# Altium schematic sheet MCU.SchDoc
size A4
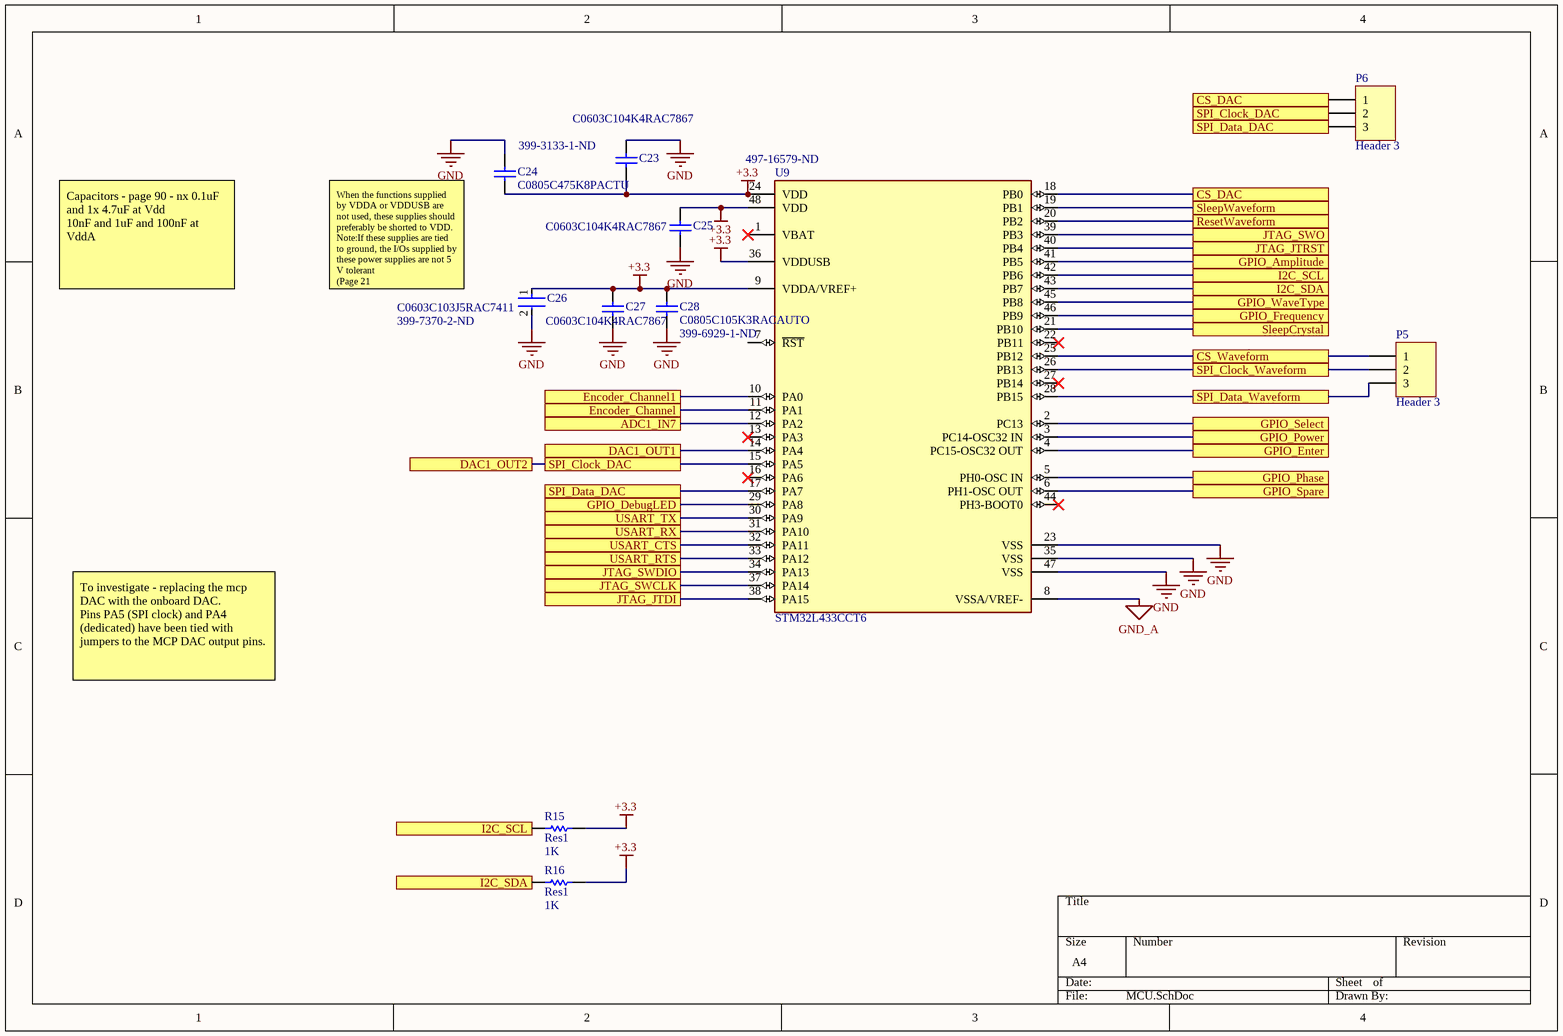
[diagram p0: MCU.SchDoc]

## Parts
C23  C0603C104K4RAC7867  [CAPC1608X87X35NL15T15]
C24  C0805C475K8PACTU  Supplier Part Number 1: 399-3133-1-ND  [CAPC2013X145X50ML20T25]
C25  C0603C104K4RAC7867  [CAPC1608X87X35NL15T15]
C26  C0603C103J5RAC7411  Supplier Part Number 1: 399-7370-2-ND  [FP-C0603C-CF-MFG]
C27  C0603C104K4RAC7867  [CAPC1608X87X35NL15T15]
C28  C0805C105K3RACAUTO  Supplier Part Number 1: 399-6929-1-ND  [CAPC2013X140X50ML20T25]
P5  Header 3  [HDR1X3]
P6  Header 3  [HDR1X3]
R15  Res1  value 1K  [AXIAL-0.3]
R16  Res1  value 1K  [AXIAL-0.3]
U9  STM32L433CCT6  Supplier Part Number 1: 497-16579-ND  [FP-LQFP48-5B-MFG]

## Ports
ADC1_IN7, CS_DAC, CS_Waveform, DAC1_OUT1, DAC1_OUT2, Encoder_Channel, Encoder_Channel1, GPIO_Amplitude, GPIO_DebugLED, GPIO_Enter, GPIO_Frequency, GPIO_Phase, GPIO_Power, GPIO_Select, GPIO_Spare, GPIO_WaveType, I2C_SCL, I2C_SDA, JTAG_JTDI, JTAG_JTRST, JTAG_SWCLK, JTAG_SWDIO, JTAG_SWO, ResetWaveform, SleepCrystal, SleepWaveform, SPI_Clock_DAC, SPI_Clock_Waveform, SPI_Data_DAC, SPI_Data_Waveform, USART_CTS, USART_RTS, USART_RX, USART_TX

## Nets
+3.3: C23.1 C24.1 C25.2 C26.1 C27.2 C28.2 R15.2 R16.2 U9.9(VDDA/VREF+) U9.24(VDD) U9.36(VDDUSB) U9.48(VDD)
GND: C23.2 C24.2 C25.1 C26.2 C27.1 C28.1 U9.23(VSS) U9.35(VSS) U9.47(VSS)
GND_A: U9.8(VSSA/VREF-)
ADC1_IN7: U9.12(PA2) ; port ADC1_IN7
CS_DAC: P6.1 U9.18(PB0) ; port CS_DAC
CS_Waveform: P5.1 U9.25(PB12) ; port CS_Waveform
DAC1_OUT1: U9.14(PA4) ; port DAC1_OUT1
DAC1_OUT2: P6.2 U9.15(PA5) ; port DAC1_OUT2, port SPI_Clock_DAC
Encoder_Channel: U9.11(PA1) ; port Encoder_Channel
Encoder_Channel1: U9.10(PA0) ; port Encoder_Channel1
GPIO_Amplitude: U9.41(PB5) ; port GPIO_Amplitude
GPIO_DebugLED: U9.29(PA8) ; port GPIO_DebugLED
GPIO_Enter: U9.4(PC15-OSC32_OUT) ; port GPIO_Enter
GPIO_Frequency: U9.46(PB9) ; port GPIO_Frequency
GPIO_Phase: U9.5(PH0-OSC_IN) ; port GPIO_Phase
GPIO_Power: U9.3(PC14-OSC32_IN) ; port GPIO_Power
GPIO_Select: U9.2(PC13) ; port GPIO_Select
GPIO_Spare: U9.6(PH1-OSC_OUT) ; port GPIO_Spare
GPIO_WaveType: U9.45(PB8) ; port GPIO_WaveType
I2C_SCL: R15.1 U9.42(PB6) ; port I2C_SCL
I2C_SDA: R16.1 U9.43(PB7) ; port I2C_SDA
JTAG_JTDI: U9.38(PA15) ; port JTAG_JTDI
JTAG_JTRST: U9.40(PB4) ; port JTAG_JTRST
JTAG_SWCLK: U9.37(PA14) ; port JTAG_SWCLK
JTAG_SWDIO: U9.34(PA13) ; port JTAG_SWDIO
JTAG_SWO: U9.39(PB3) ; port JTAG_SWO
ResetWaveform: U9.20(PB2) ; port ResetWaveform
SleepCrystal: U9.21(PB10) ; port SleepCrystal
SleepWaveform: U9.19(PB1) ; port SleepWaveform
SPI_Clock_Waveform: P5.2 U9.26(PB13) ; port SPI_Clock_Waveform
SPI_Data_DAC: P6.3 U9.17(PA7) ; port SPI_Data_DAC
SPI_Data_Waveform: P5.3 U9.28(PB15) ; port SPI_Data_Waveform
USART_CTS: U9.32(PA11) ; port USART_CTS
USART_RTS: U9.33(PA12) ; port USART_RTS
USART_RX: U9.31(PA10) ; port USART_RX
USART_TX: U9.30(PA9) ; port USART_TX

Not connected (* = marked no-connect by the designer): U9 1(VBAT)* 7(~{RST}) 13(PA3)* 16(PA6)* 22(PB11)* 27(PB14)* 44(PH3-BOOT0)*

## Notes on the sheet
- Capacitors - page 90 - nx 0.1uF and 1x 4.7uF at Vdd
  10nF and 1uF and 100nF at VddA
- (near C24) When the functions supplied by VDDA or VDDUSB are not used, these supplies should preferably be shorted to VDD.
  Note:If these supplies are tied to ground, the I/Os supplied by these power supplies are not 5 V tolerant
  (Page 21
- To investigate - replacing the mcp DAC with the onboard DAC.
  Pins PA5 (SPI clock) and PA4 (dedicated) have been tied with jumpers to the MCP DAC output pins.

## Library data of the parts
C23 C25 C27 = CMP-2006-03811-1: 0.1uF Ceramic; Manufacturer: Kemet; Capacitance: 100nF; Voltage Rating: 16V; Tolerance: 10%; Dielectric: X7R; Dissipation Factor: 3.5%; Part Number: C0603C104K4RAC7867; RoHS: Yes; Category: Ceramic Capacitors; Stock 1: 2000839; Pricing 1: 1=0.12000, 10=0.08700, 50=0.04720, 100=0.03850, 500=0.02752, 1000=0.02163 (USD); Mount: Surface Mount,PCB; Case/Package: 0603; Number of Pins: 2; Case Code (Metric): 1608; Case Code (Imperial): 0603; Dielectric Material: Ceramic; Contact Plating: Tin,Matte; Min Operating Temperature: -55°C; Max Operating Temperature: 125°C; Package Quantity: 4000; Packaging: Tape and Reel; Voltage Rating (DC): 16V; Termination: SMD/SMT; Voltage: 16V; Length: 1.6mm; Height: 0.8mm; Width: 0.8mm; Thickness: 0.034inch; Depth: 0.8mm; Lead Pitch: 0.7mm; Radiation Hardening: No; REACH SVHC: No SVHC; ComponentLink1URL: https://datasheet.ciiva.com/14589/70095383-14589014.pdf?src-supplier=Allied+Electronics; ComponentLink1Description: https://datasheet.ciiva.com/14589/70095383-14589014.pdf?src-supplier=Allied+Electronics; ComponentLink2URL: https://datasheet.ciiva.com/18192/getdatasheetpartid-330584-18192695.pdf?src-supplier=Verical; ComponentLink2Description: https://datasheet.ciiva.com/18192/getdatasheetpartid-330584-18192695.pdf?src-supplier=Verical; ComponentLink3URL: https://datasheet.ciiva.com/22749/kem-c1002-x7r-smd-22749657.pdf?src-supplier=Element14; ComponentLink3Description: https://datasheet.ciiva.com/22749/kem-c1002-x7r-smd-22749657.pdf?src-supplier=Element14; ComponentLink4URL: https://datasheet.ciiva.com/5413/kem-c1002-x7r-smd-5413791.pdf?src-supplier=Mouser; ComponentLink4Description: https://datasheet.ciiva.com/5413/kem-c1002-x7r-smd-5413791.pdf?src-supplier=Mouser
C24 = CMP-2007-01007-1: Manufacturer: Kemet; Dielectric Material: Ceramic; Tolerance: 10%; Capacitance: 4.7uF; Voltage Rating (DC): 10V; Dielectric: X5R; Dissipation Factor: 5%; Part Number: C0805C475K8PACTU; Supplier 1: Digi-Key; Manufacturer Part Number: C0805C475K8PACTU; RoHS: Yes; Category: Ceramic Capacitors; Stock 1: 286427; Pricing 1: 1=0.25000, 10=0.17100, 50=0.10240, 100=0.08640, 500=0.05914, 1000=0.05232 (USD); Mount: Surface Mount; Case/Package: 0805; Number of Pins: 2; Case Code (Imperial): 0805; Case Code (Metric): 2012; Min Operating Temperature: -55°C; Max Operating Temperature: 85°C; Packaging: Tape and Reel; Termination: SMD/SMT; Package Quantity: 1; Voltage Rating: 10V; Voltage: 10V; Length: 2mm; Height: 1.25mm; Width: 1.2mm; Thickness: 0.055inch; Depth: 1.25mm; Lead Pitch: 0.75mm; Radiation Hardening: No; Lead Free: Lead Free; REACH SVHC: No SVHC; ComponentLink1URL: https://datasheet.ciiva.com/18193/getdatasheetpartid-179373-18193909.pdf?src-supplier=Verical; ComponentLink1Description: https://datasheet.ciiva.com/18193/getdatasheetpartid-179373-18193909.pdf?src-supplier=Verical; ComponentLink2URL: https://datasheet.ciiva.com/7842/40889-7842616.pdf?src-supplier=Element14; ComponentLink2Description: https://datasheet.ciiva.com/7842/40889-7842616.pdf?src-supplier=Element14; ComponentLink3URL: https://datasheet.ciiva.com/6126/40889-6126699.pdf?src-supplier=Farnell; ComponentLink3Description: https://datasheet.ciiva.com/6126/40889-6126699.pdf?src-supplier=Farnell; ComponentLink4URL: https://datasheet.ciiva.com/28614/1918694-28614763.pdf?src-supplier=Element14; ComponentLink4Description: https://datasheet.ciiva.com/28614/1918694-28614763.pdf?src-supplier=Element14; ComponentLink5URL: https://datasheet.ciiva.com/46385/1791935-46385676.pdf?src-supplier=Element14; ComponentLink5Description: https://datasheet.ciiva.com/46385/1791935-46385676.pdf?src-supplier=Element14
C26 = CMP-03020-011072-1: CAP CER 10000PF 50V X7R 0603; Manufacturer: KEMET; Value: 10,000 pF; Tolerance: 0.05; Automotive Grade: Grade 1; Material: Ceramic; Temperature Coefficient: 30ppm/°C; Dissipation Factor: 2.5%; Lead Free: Yes; Voltage Rating: 50 V; Temperature: -55°C to +125°C; Digikey Description: CAP CER 10000PF 50V X7R 0603; Device Class L2: Capacitors; Package: C0603C-CF; Device Class L3: Ceramic Capacitors; Height: 0.87mm; ComponentLink2Description: Datasheet; Temperature Range High: +125°C; Capacitance: 10,000 pF; Octopart: https://octopart.com/c0603c103j5rac7411-kemet-3901156; ComponentLink2URL: https://api.kemet.com/component-edge/download/datasheet/C0603C100J5GACAUTO.pdf; Category: Cap; Automotive: Yes; Temperature Range Low: -55°C; Mouser Description: Cap Ceramic 0.01uF 50V X7R 5% SMD 0603 125°C Punched Paper T/R; Temperature Characteristic: X7R; RoHS: TRUE; Manufacturer Part Number: C0603C103J5RAC7411; Device Class L1: Passive Components; Supplier 1: Digi-Key; Stock 1: 15000; Pricing 1: 15000=0.00836, 30000=0.00794, 75000=0.00711 (USD); Mount: Surface Mount; Case/Package: 0603; Case Code (Metric): 1608; Case Code (Imperial): 0603; Dielectric Material: Ceramic; Min Operating Temperature: -55°C; Max Operating Temperature: 125°C; Packaging: Tape and Reel; Voltage Rating (DC): 50V; Dielectric: X7R; Package Quantity: 15000; Termination: SMD/SMT; Length: 1.6mm; Width: 0.031inch; Depth: 0.8mm; Thickness: 0.035inch; Lead Pitch: 0.7mm; ComponentLink1URL: https://datasheet.ciiva.com/5411/kem-c1002-x7r-smd-357932-5411286.pdf?src-supplier=Mouser; ComponentLink1Description: https://datasheet.ciiva.com/5411/kem-c1002-x7r-smd-357932-5411286.pdf?src-supplier=Mouser
C28 = CMP-2007-03233-1: Manufacturer: Kemet; Dielectric Material: Ceramic; Capacitance: 1uF; Tolerance: 10%; Dielectric: X7R; Voltage Rating (DC): 25V; Part Number: C0805C105K3RACAUTO; Supplier 1: Digi-Key; Manufacturer Part Number: C0805C105K3RACAUTO; RoHS: Yes; Category: Ceramic Capacitors; Stock 1: 71727; Pricing 1: 1=0.18000, 10=0.12100, 50=0.07280, 100=0.06140, 500=0.04204, 1000=0.03719 (USD); Mount: Surface Mount; Case/Package: 0805; Case Code (Metric): 2012; Case Code (Imperial): 0805; Min Operating Temperature: -55°C; Max Operating Temperature: 125°C; Packaging: Cut Tape; Voltage Rating: 25V; Package Quantity: 1; Length: 2mm; Height: 1.25mm; Width: 0.049inch; Thickness: 0.055inch; Depth: 1.25mm; Ratings: AEC-Q200; Radiation Hardening: No; REACH SVHC: No SVHC; ComponentLink1URL: https://datasheet.ciiva.com/6074/1732735-6074357.pdf?src-supplier=Farnell; ComponentLink1Description: https://datasheet.ciiva.com/6074/1732735-6074357.pdf?src-supplier=Farnell; ComponentLink2URL: https://datasheet.ciiva.com/7842/1732735-7842186.pdf?src-supplier=Element14; ComponentLink2Description: https://datasheet.ciiva.com/7842/1732735-7842186.pdf?src-supplier=Element14
P5 P6 = Header 3: Header, 3-Pin; LatestRevisionDate: 17-Jul-2002; LatestRevisionNote: Re-released for DXP Platform.; Publisher: Altium Limited
R15 R16 = Res1: Resistor; Published: 8-Jun-2000; LatestRevisionDate: 17-Jul-2002; LatestRevisionNote: Re-released for DXP Platform.; PackageReference: AXIAL-0.3; Publisher: Altium Limited; PackageDescription: Axial Device, Thru-Hole; 2 Leads; 0.3 in Pin Spacing
U9 = CMP-12105-000047-1: IC MCU 32BIT 256KB FLASH 48LQFP; Manufacturer: STMicroelectronics; Max Junction Temp: +105°C; Min Supply Voltage: 1.55V; Number Of Uart Channels: 4; Number Of I2C Channels: 3; Max Supply Voltage: 3.6V; Number Of I/Os: 38; Number Of Usb Channels: 1; Memory Size: 256KBytes; Interface: I2C,SPI,UART,USART,CAN,USB,LIN,IrDA,SMBus,Other; Ram Size: 64KBytes; Standoff Height: 0.05mm; Number Of Pwm Channels: 14; Number Of Timers/Counters: 9; Frequency: 80MHz; Data Bus Width: 32bits; Number Of Adc Channels: 10; Core Architecture: Arm Cortex-M4; Peripherals: Brown-out Detect/Reset,PWM,WDT,DMA,LCD; Oscillator Type: Internal; Digikey Description: IC MCU 32BIT 256KB FLASH 48LQFP; Category: IC; Ambient Temperature Range High: +85°C; Number Of Spi Channels: 3; Temperature Range High: +85°C; ComponentLink2Description: Datasheet; Device Class L3: Microcontrollers; Device Class L2: Embedded Processors and Controllers; Temperature Range Low: -40°C; Ambient Temperature Range Low: -40°C; Manufacturer Part Number: STM32L433CCT6; Automotive: No; Package: LQFP48-5B; Ipc Land Pattern Name: QFP50P900X900X160-48; RoHS: TRUE; Octopart: https://octopart.com/stm32l433cct6-stmicroelectronics-71093511; Number Of A/D Converters: 1; Memory Type: FLASH; Lead Free: Yes; ComponentLink2URL: https://www.st.com/resource/en/datasheet/stm32l433cc.pdf; Device Class L1: Integrated Circuits (ICs); Temperature: -40°C to +85°C; Number Of Cores: 1; Height: 1.6mm; Supplier 1: Digi-Key; Stock 1: 5865; Pricing 1: 1=5.73000, 10=5.15000, 25=4.86840, 100=4.21940, 250=4.00304, 500=3.59190, 1000=3.02932, 2500=2.87786, 5000=2.76966 (USD); Case/Package: LQFP; Min Operating Temperature: -40°C; Max Operating Temperature: 85°C; Packaging: Tray; ComponentLink1URL: http://www.farnell.com/datasheets/2283392.pdf?src-supplier=Farnell; ComponentLink1Description: http://www.farnell.com/datasheets/2283392.pdf?src-supplier=Farnell; ComponentLink3URL: http://www.farnell.com/datasheets/2283392.pdf?src-supplier=Newark; ComponentLink3Description: http://www.farnell.com/datasheets/2283392.pdf?src-supplier=Newark; ComponentLink4URL: http://www.st.com/content/ccc/resource/technical/document/datasheet/f7/a0/fc/27/24/4e/4f/3f/DM00257192.pdf/files/DM00257192.pdf/jcr:content/translations/en.DM00257192.pdf?src-supplier=Digi-Key; ComponentLink4Description: http://www.st.com/content/ccc/resource/technical/document/datasheet/f7/a0/fc/27/24/4e/4f/3f/DM00257192.pdf/files/DM00257192.pdf/jcr:content/translations/en.DM00257192.pdf?src-supplier=Digi-Key; ComponentLink5URL: http://www.farnell.com/datasheets/2283392.pdf?src-supplier=Element14; ComponentLink5Description: http://www.farnell.com/datasheets/2283392.pdf?src-supplier=Element14